# Altium schematic sheet imu-pcb.SchDoc
size A4
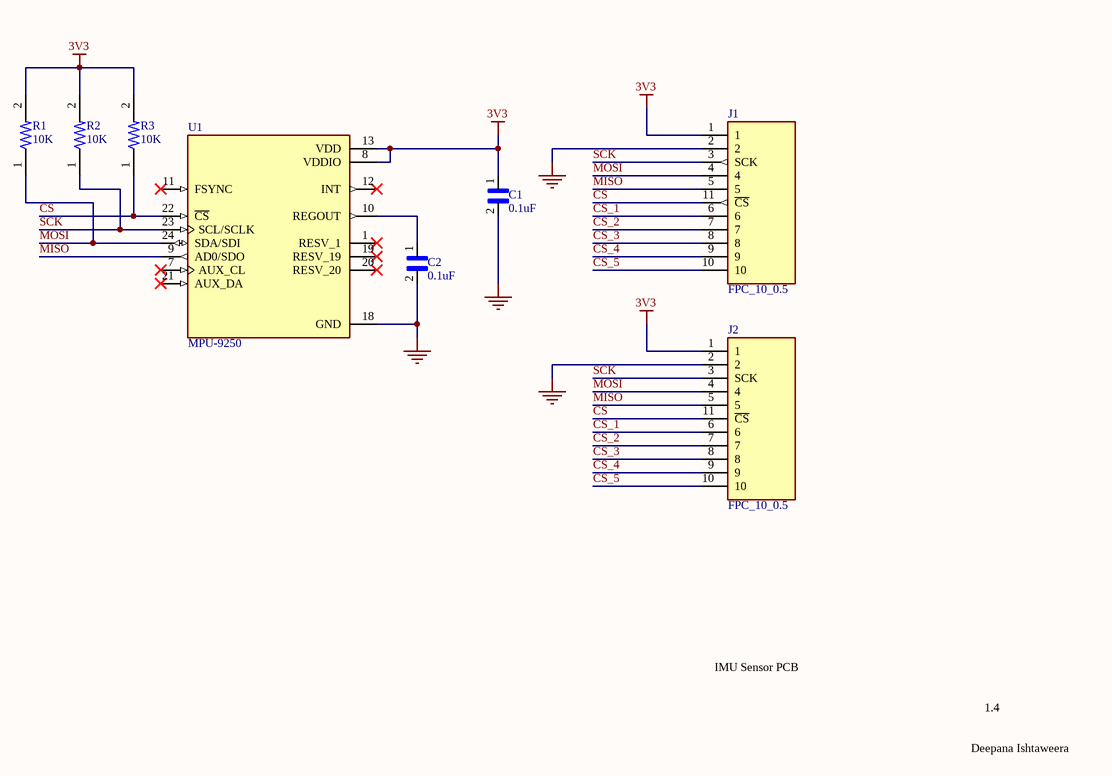
[diagram p0: imu-pcb.SchDoc]

## Parts
C1  0.1uF  [CAPC1608X87N]
C2  0.1uF  [CAPC1608X87N]
J1  FPC_10_0.5  [FPC_10_0.5]
J2  FPC_10_0.5  [FPC_10_0.5_1]
R1  10K  [RESC1608X50N]
R2  10K  [RESC1608X50N]
R3  10K  [RESC1608X50N]
U1  MPU-9250  [QFN40P300X300X105-24N]

## Nets
3V3: C1.1 J1.1 J2.1 R1.2 R2.2 R3.2 U1.8(VDDIO) U1.13(VDD)
GND: C1.2 C2.2 J1.2 J2.2 U1.18(GND)
CS: J1.11(~{CS}) J2.11(~{CS}) R3.1 U1.22(~{CS})
CS_1: J1.6 J2.6
CS_2: J1.7 J2.7
CS_3: J1.8 J2.8
CS_4: J1.9 J2.9
CS_5: J1.10 J2.10
MISO: J1.5 J2.5 U1.9(AD0/SDO)
MOSI: J1.4 J2.4 R1.1 U1.24(SDA/SDI)
SCK: J1.3(SCK) J2.3(SCK) R2.1 U1.23(SCL/SCLK)
NetC2_1: C2.1 U1.10(REGOUT)

Not connected (* = marked no-connect by the designer): U1 1(RESV_1)* 7(AUX_CL)* 11(FSYNC)* 12(INT)* 19(RESV_19)* 20(RESV_20)* 21(AUX_DA)*

## Notes on the sheet
- IMU Sensor PCB
- 1.4
- Deepana Ishtaweera

## Library data of the parts
C1 C2 = 0603B103K500CT: 10000pF Â±10% 50V Ceramic Capacitor X7R 0603 (1608 Metric); MF: Walsin Technology; Value: *; Price: None; SnapEDA_Link: https://www.snapeda.com/parts/0603B103K500CT/Walsin%20Technology%20Corporation/view-part/424904/?ref=snap; Availability: Unavailable; MP: 0603B103K500CT; Mouser-Purchase-URL: https://snapeda.com/shop?store=Mouser&id=424904; Package: 0603 Walsin Technologies; DigiKey-Purchase-URL: https://snapeda.com/shop?store=DigiKey&id=424904
J1 = FPC_10_0.5: 6 Position FPC Connector Contacts, Bottom 0.020 (0.50mm) Surface Mount, Right Angle; MP: 1734592-6; MF: TE Connectivity; Package: None; SnapEDA_Link: https://www.snapeda.com/parts/1734592-6/TE%20Connectivity/view-part/4788517/?ref=snap; Price: None; Availability: Unavailable; Value: *
J2 = FPC_10_0.5_1: 6 Position FPC Connector Contacts, Bottom 0.020 (0.50mm) Surface Mount, Right Angle; MP: 1734592-6; MF: TE Connectivity; Package: None; SnapEDA_Link: https://www.snapeda.com/parts/1734592-6/TE%20Connectivity/view-part/4788517/?ref=snap; Price: None; Availability: Unavailable; Value: *
R1-R3 = RES-0603: RES SMD 10 OHM 0.1% 1/16W 0603; Voltage_Rating: 50 V; Power_Rating: .063 W; Resistance: 10; MF: TE Connectivity; MP: 8-1614350-7; Tolerance: .1%; Availability: Warning; Price: None; SnapEDA_Link: https://www.snapeda.com/parts/8-1614350-7/TE%20Connectivity/view-part/2208042/?ref=snap; EU_RoHS_Compliance: Compliant; Value: *; Package: 0603; Comment_1: *
U1 = MPU-9250: Accelerometer, Gyroscope, Magnetometer, 9 Axis Sensor IÂ²C, SPI Output; MF: TDK InvenSense; SnapEDA_Link: https://www.snapeda.com/parts/MPU-9250/TDK%20InvenSense/view-part/4652549/?ref=snap; Value: *; MP: MPU-9250; Availability: Unavailable; Package: TFQFN-24 TDK InvenSense; Price: None